# EAGLE design reed (EAGLE 6.6.0)
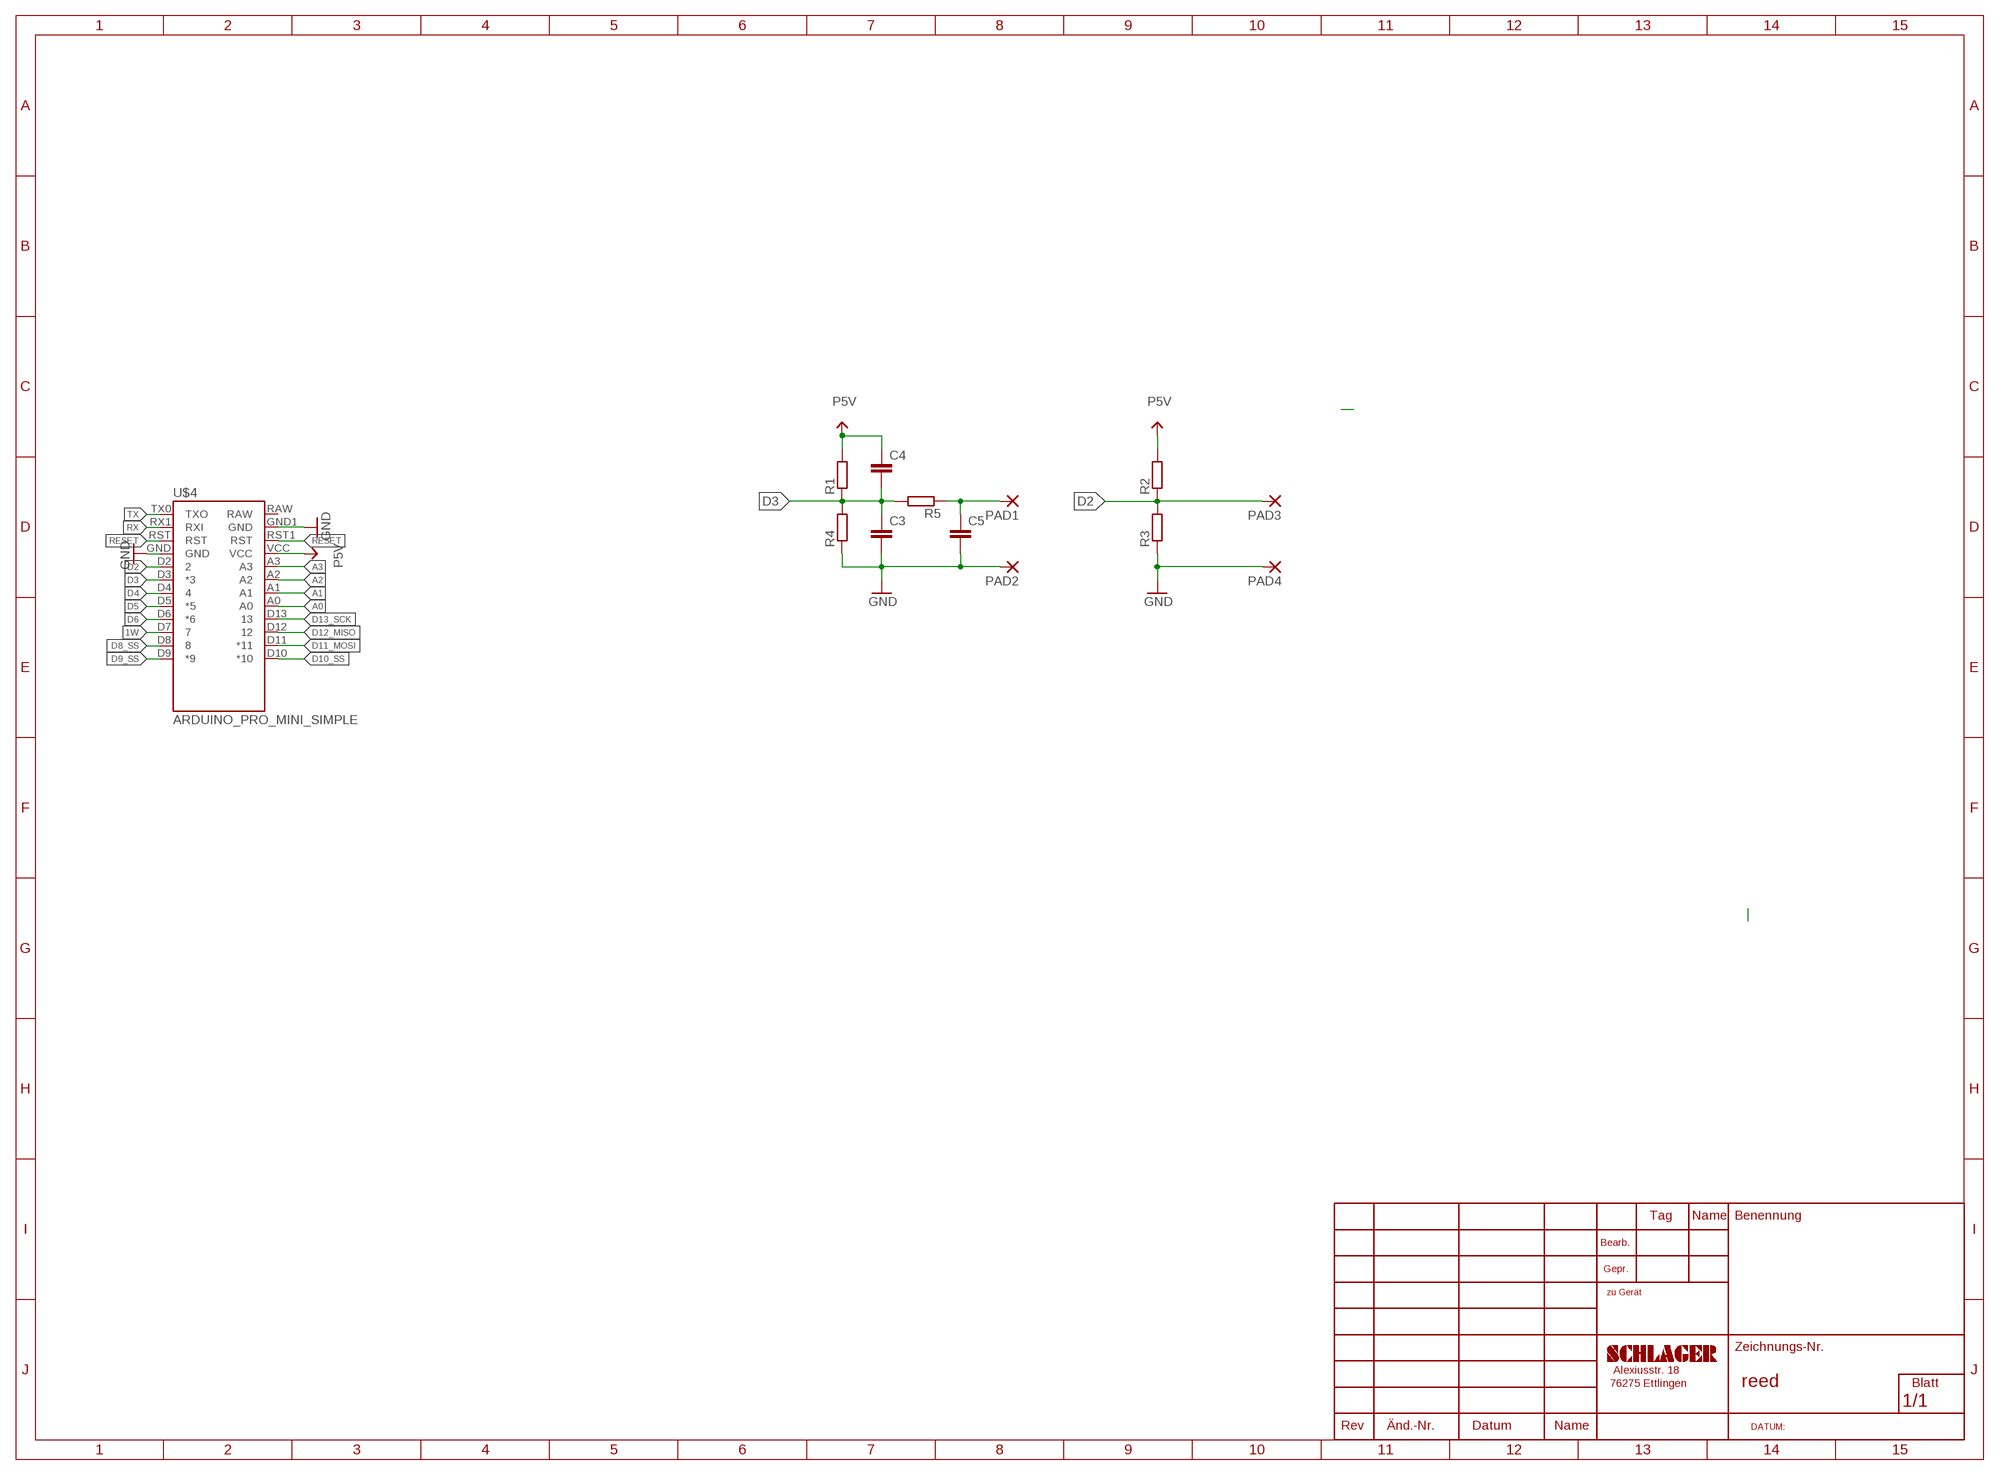
[diagram p0: schematic, sheet 1]

## Parts
C3  C-EUC0603K  [C0603K]
C4  C-EUC0603K  [C0603K]
C5  C-EUC0603K  [C0603K]
PAD1  SMD2  [SMD1,27-2,54]
PAD2  SMD2  [SMD1,27-2,54]
PAD3  SMD2  [SMD1,27-2,54]
PAD4  SMD2  [SMD1,27-2,54]
R1  R-EU_R0603  [R0603]
R2  R-EU_R0603  [R0603]
R3  R-EU_R0603  [R0603]
R4  R-EU_R0603  [R0603]
R5  R-EU_R0603  [R0603]
U$4  ARDUINO_PRO_MINI_SIMPLE  [PRO_MINI_SIMPLE]

## Nets
1W: U$4.D7
A0: U$4.A0
A1: U$4.A1
A2: U$4.A2
A3: U$4.A3
D2: PAD3.1(P) R2.1 R3.2 U$4.D2
D3: C3.1 C4.2 R1.1 R4.2 R5.2 U$4.D3(*3)
D4: U$4.D4
D5: U$4.D5(*5)
D6: U$4.D6(*6)
D8_SS: U$4.D8
D9_SS: U$4.D9(*9)
D10_SS: U$4.D10(*10)
D11_MOSI: U$4.D11(*11)
D12_MISO: U$4.D12
D13_SCK: U$4.D13
GND: C3.2 C5.2 PAD2.1(P) PAD4.1(P) R3.1 R4.1 U$4.GND U$4.GND1(GND)
N$5: C5.1 PAD1.1(P) R5.1
P5V: C4.1 R1.2 R2.2 U$4.VCC
RESET: U$4.RST U$4.RST1(RST)
RX: U$4.RX1(RXI)
TX: U$4.TX0(TXO)
Unconnected: U$4.RAW

## Library data of the parts
C3-C5 = debauer_passiv:C-EU: CAPACITOR, European symbol
PAD1-PAD4 = wirepad:SMD2: SMD PAD
R1-R5 = debauer_passiv:R-EU_: RESISTOR, European symbol
U$4 = debauer_modules:ARDUINO_PRO_MINI_SIMPLE

## Net classes
4 USBpair: width 0.254 mm, drill 0.406 mm, clearance 0.508 mm

## Board
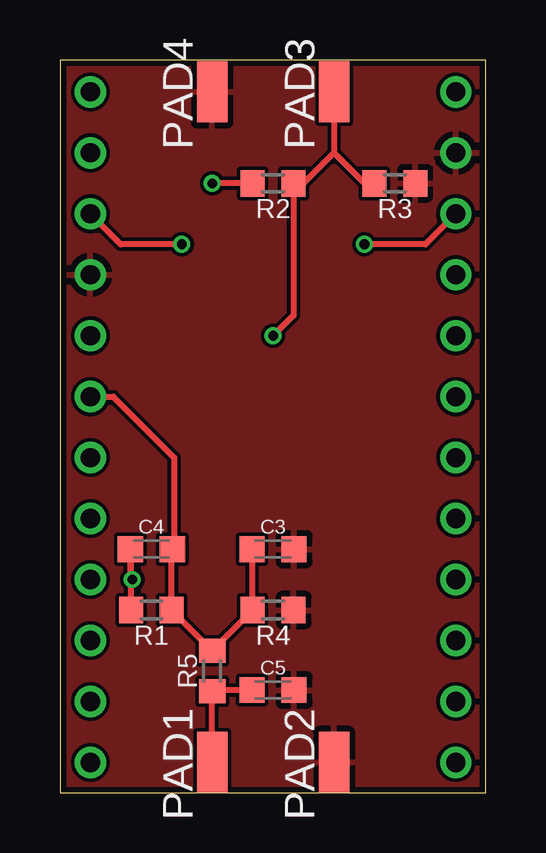
[diagram p1: board, top side]
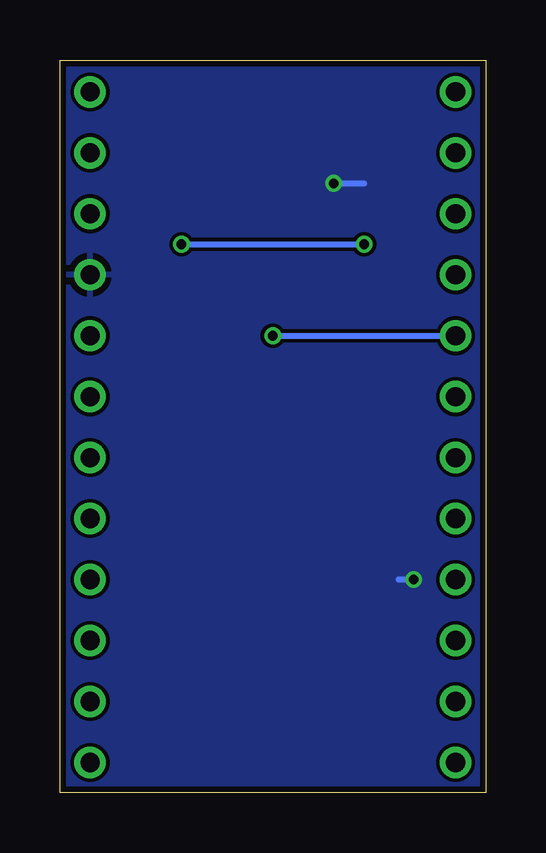
[diagram p2: board, bottom side, seen from below]

Size 17.77 x 30.54 mm. Coordinates in mm from the lower left corner, seen from the top.
Outline: 0,0 17.77,0 17.77,30.54 0,30.54 0,0
Copper layers (1*16): Top 0.035mm / dielectric 1.5mm / Bottom 0.035mm
Design rules "ITEADstudio_DRC": minimum track width 6mil, minimum drill 12mil, track to track 6mil, track to pad 6mil, pad to pad 6mil, via to via 6mil, smd to smd 0mil, copper to edge 10mil, drill to drill 10mil, minimum pad ring 10mil, minimum via ring 6mil, stop-mask expansion 2mil, vias tented up to drill 100mil, thermal gap 10mil

### Footprints (pad centres in the part's own frame; a part is rotated, then mirrored left to right if it is on the bottom)
C0603K = smd 1.05 x 1.08: 1 -0.875,0; 2 0.875,0
SMD1,27-2,54 = smd 1.27 x 2.54: 1 0,0
R0603 = smd 1 x 1.1: 1 -0.85,0; 2 0.85,0
PRO_MINI_SIMPLE = drill 0.8: A0 7.62,3.81; A1 7.62,1.27; A2 7.62,-1.27; A3 7.62,-3.81; D2 -7.62,3.81; D3 -7.62,1.27; D4 -7.62,-1.27; D5 -7.62,-3.81; D6 -7.62,-6.35; D7 -7.62,-8.89; D8 -7.62,-11.43; D9 -7.62,-13.97; D10 7.62,-13.97; D11 7.62,-11.43; D12 7.62,-8.89; D13 7.62,-6.35; GND 7.62,11.43; GND1 -7.62,6.35; RAW 7.62,13.97; RST 7.62,8.89; RST1 -7.62,8.89; RX1 -7.62,11.43; TX0 -7.62,13.97; VCC 7.62,6.35

### Placement (x,y rotation side)
C3  8.89,10.16 0 top
C4  3.81,10.16 0 top
C5  8.89,4.29 0 top
PAD1  6.35,1.27 0 top
PAD2  11.43,1.27 0 top
PAD3  11.43,29.21 0 top
PAD4  6.35,29.21 0 top
R1  3.81,7.62 180 top
R2  8.89,25.4 180 top
R3  13.97,25.4 180 top
R4  8.89,7.62 180 top
R5  6.35,5.08 90 top
U$4  8.89,15.24 0 top

### Tracks (layer width: path | path; a pad name or v marks a point on that pad's centre or on a via)
D2  (via drill 0.4)
  Top 0.254: PAD3.1 11.43,26.67 | 11.43,26.67 10.16,25.4 R2.1 9.74,19.9 v8.89,19.05 | R3.2 12.7,25.4 11.43,26.67
  Bottom 0.254: v8.89,19.05 U$4.D2
D3
  Top 0.254: C3.1 8.02,7.64 R4.2 R5.2 R1.1 4.66,10.13 C4.2 4.76,10.24 4.76,13.97 2.22,16.51 U$4.D3
GND
  pour Top: -2.54,33.02 21.59,33.02 21.59,-2.54 -2.54,-2.54
N$5
  Top 0.254: PAD1.1 R5.1 6.93,4.29 C5.1
P5V  (via drill 0.4)
  Top 0.254: R2.2 v6.35,25.4 | R1.2 2.96,10.13 C4.1 2.94,8.97 v3.02,8.89
  Bottom 0.254: v6.35,25.4 5.08,25.4 | v3.02,8.89 3.65,8.89
  pour Bottom: -5.08,35.56 24.13,35.56 24.13,-5.08 -5.08,-5.08
RESET  (via drill 0.4)
  Top 0.254: U$4.RST 15.24,22.86 v12.7,22.86 | v5.08,22.86 2.54,22.86 U$4.RST1
  Bottom 0.254: v12.7,22.86 v5.08,22.86